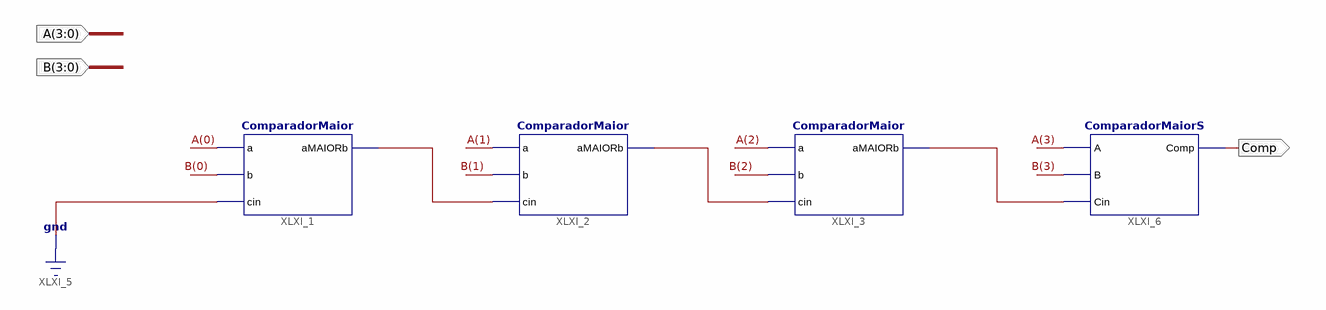
[diagram p0: schematic sheet 1]
// Xilinx ISE schematic ComparadorMaiorCompleto.sch (xa9500xl) as structural Verilog: 4 symbols, 3 ports
module ComparadorMaiorCompleto (
  input  [3:0] A,
  input  [3:0] B,
  output Comp
);

  wire XLXN_1, XLXN_2, XLXN_3;

  ComparadorMaior XLXI_1 (.a(A[0]), .b(B[0]), .cin(1'b0), .aMAIORb(XLXN_1));
  ComparadorMaior XLXI_2 (.a(A[1]), .b(B[1]), .cin(XLXN_1), .aMAIORb(XLXN_2));
  ComparadorMaior XLXI_3 (.a(A[2]), .b(B[2]), .cin(XLXN_2), .aMAIORb(XLXN_3));
  ComparadorMaiorS XLXI_6 (.A(A[3]), .B(B[3]), .Cin(XLXN_3), .Comp(Comp));
endmodule
